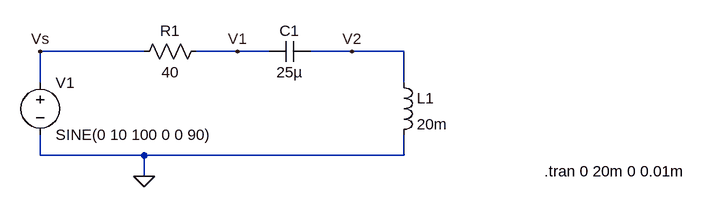
[diagram p0: schematic Draft5.asc]
Draft5.asc, the LTspice schematic file:
Version 4
SHEET 1 1064 680
WIRE 208 96 48 96
WIRE 352 96 288 96
WIRE 400 96 352 96
WIRE 528 96 464 96
WIRE 608 96 528 96
WIRE 48 144 48 96
WIRE 608 144 608 96
WIRE 48 256 48 224
WIRE 208 256 48 256
WIRE 608 256 608 224
WIRE 608 256 208 256
WIRE 208 288 208 256
FLAG 208 288 0
FLAG 48 96 Vs
FLAG 352 96 V1
FLAG 528 96 V2
SYMBOL voltage 48 128 R0
WINDOW 123 0 0 Left 0
WINDOW 39 0 0 Left 0
SYMATTR InstName V1
SYMATTR Value SINE(0 10 100 0 0 90)
SYMBOL res 304 80 R90
WINDOW 0 0 56 VBottom 2
WINDOW 3 32 56 VTop 2
SYMATTR InstName R1
SYMATTR Value 40
SYMBOL cap 464 80 R90
WINDOW 0 0 32 VBottom 2
WINDOW 3 32 32 VTop 2
SYMATTR InstName C1
SYMATTR Value 25µ
SYMBOL ind 592 128 R0
SYMATTR InstName L1
SYMATTR Value 20m
TEXT 824 280 Left 2 !.tran 0 20m 0 0.01m

The netlist it stands for:
* Draft5.asc
V1 Vs 0 SINE(0 10 100 0 0 90)
R1 V1 Vs 40
C1 V2 V1 25µ
L1 V2 0 20m
.tran 0 20m 0 0.01m
.backanno
.end

* Results of the author's LTspice run, read from the files saved beside the schematic
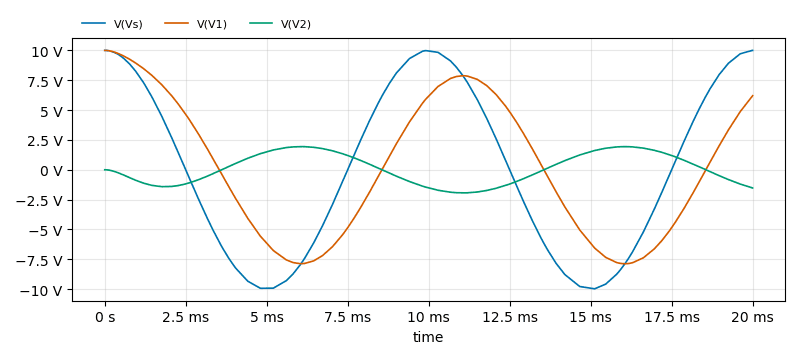
[diagram p1: Transient Analysis of Draft5.asc, plotted from the saved traces]
* Transient Analysis, 1 run:
*   V(Vs): min -9.97 V, max 10 V, average 2.457 mV, rms 7.062 V, last 10 V
*   V(V1): min -7.874 V, max 10 V, average 116.1 mV, rms 5.751 V, last 6.2 V
*   V(V2): min -1.936 V, max 1.938 V, average 94.83 mV, rms 1.278 V, last -1.525 V